# EAGLE design Fan_control_design v1.3 (EAGLE 7.7.0)
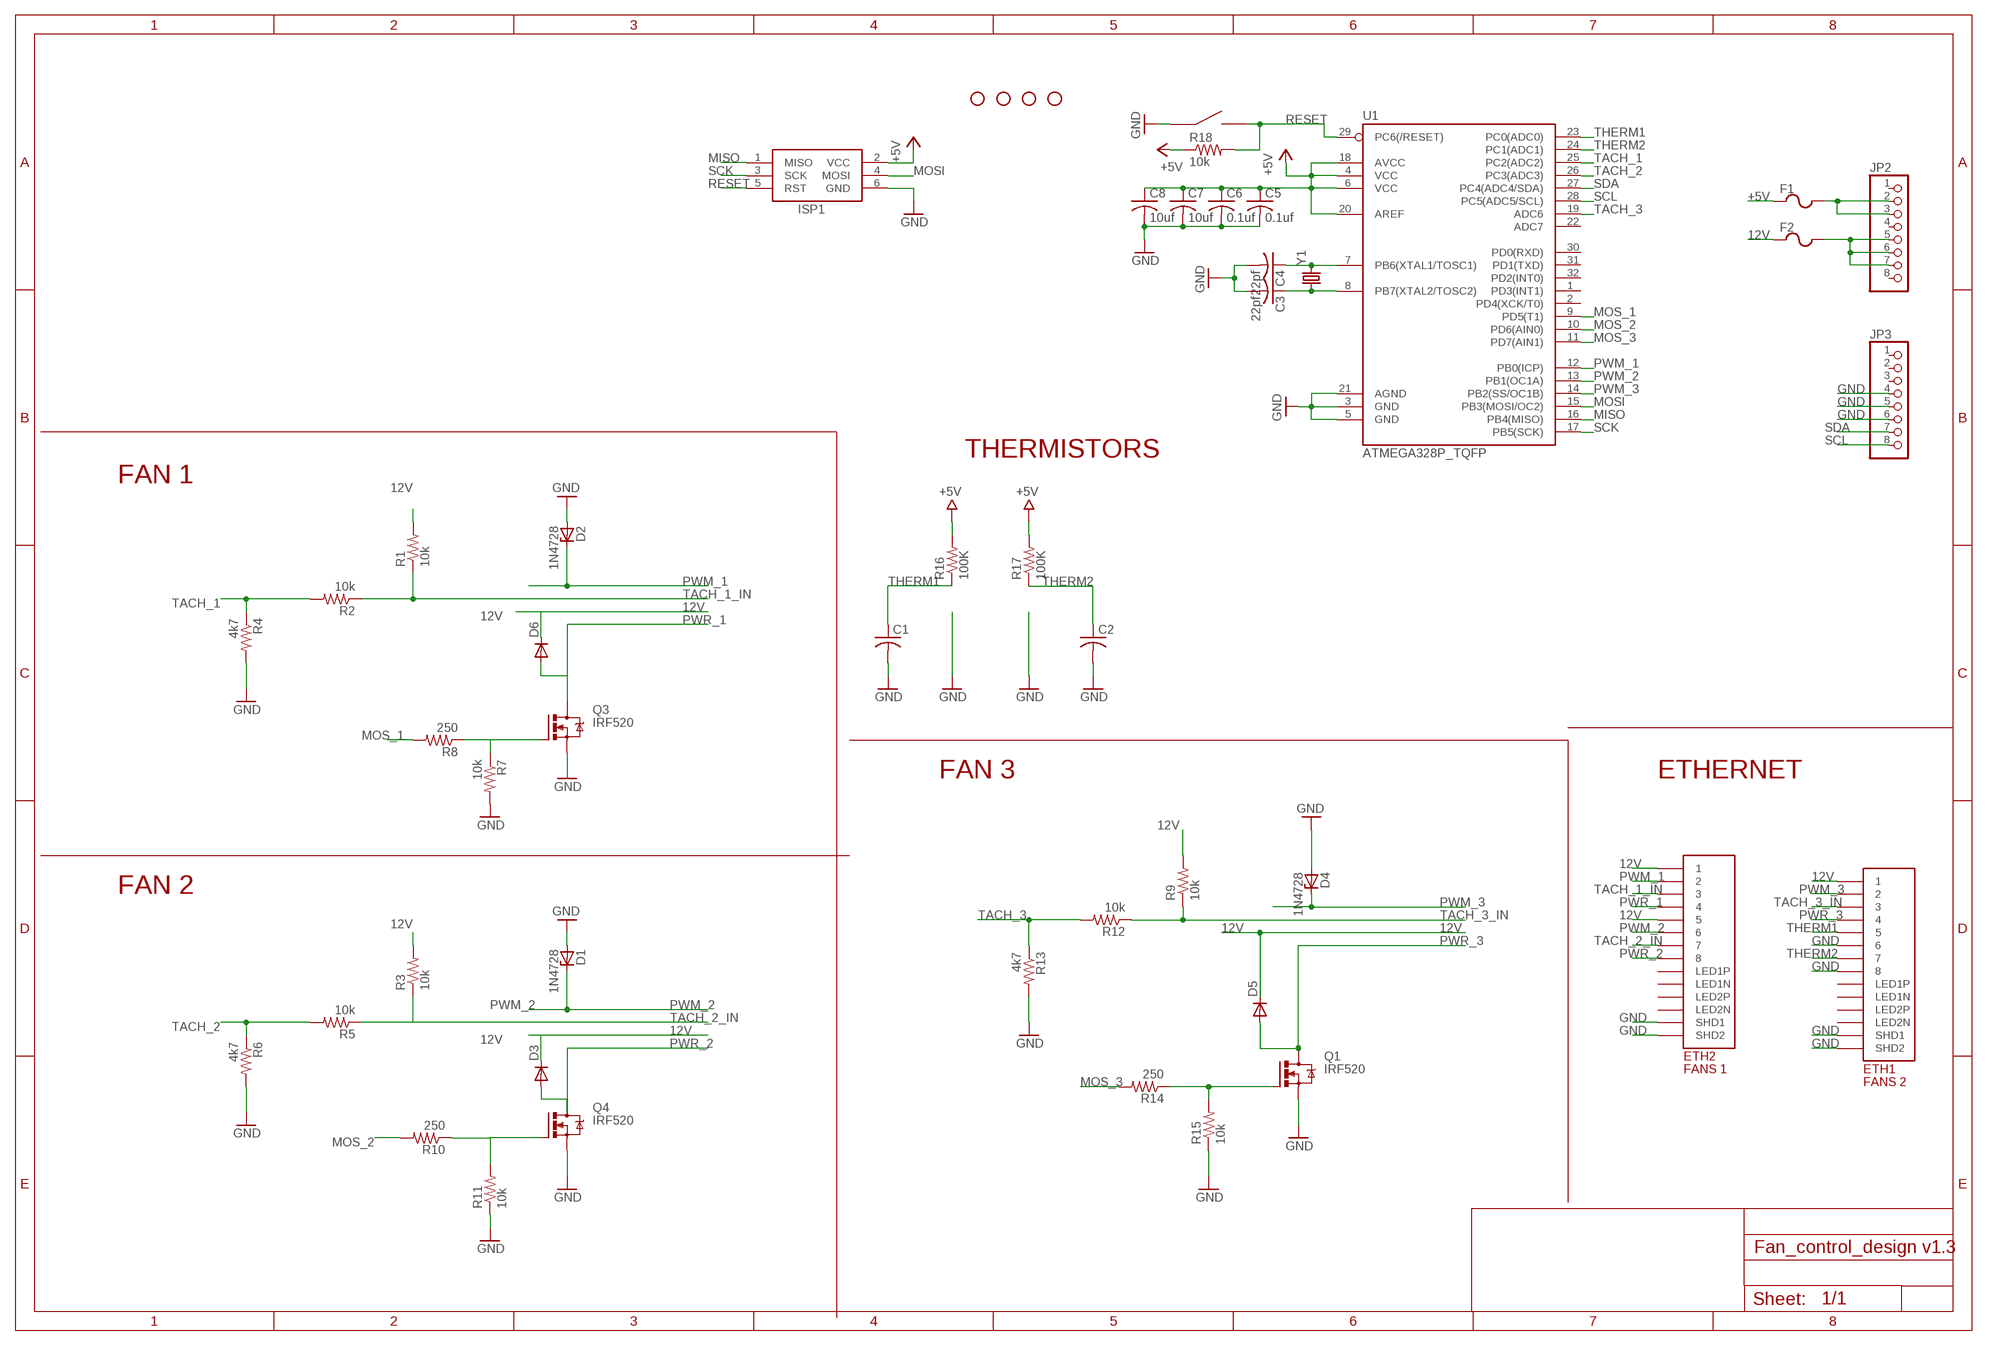
[diagram p0: schematic, sheet 1]

## Parts
C1  C-USC0603K  [C0603K]
C2  C-USC0603K  [C0603K]
C3  22pf  C-USC0603  [C0603]
C4  22pf  C-USC0603  [C0603]
C5  0.1uf  C-USC0603  [C0603]
C6  0.1uf  C-USC0603  [C0603]
C7  10uf  C-USC0603  [C0603]
C8  10uf  C-USC0603  [C0603]
D1  1N4728  [DO41Z10]
D2  1N4728  [DO41Z10]
D3  DIODE-DO214AC  [DO214AC]
D4  1N4728  [DO41Z10]
D5  DIODE-DO214AC  [DO214AC]
D6  DIODE-DO214AC  [DO214AC]
ETH1  FANS 2  ETHERNET  [A122645-ND]
ETH2  FANS 1  ETHERNET  [A122645-ND]
F1  POLYFUSE  [1206]
F2  POLYFUSE  [1206]
ISP1  AVRISP-BOX  [AVRISP-BOX]
JP2  PINHD-1X8BIG  [1X08-BIG]
JP3  PINHD-1X8BIG  [1X08-BIG]
Q1  IRF520  [TO220BV]
Q3  IRF520  [TO220BV]
Q4  IRF520  [TO220BV]
R1  10k  R-US_R0603  [R0603]
R2  10k  R-US_R0603  [R0603]
R3  10k  R-US_R0603  [R0603]
R4  4k7  R-US_R0603  [R0603]
R5  10k  R-US_R0603  [R0603]
R6  4k7  R-US_R0603  [R0603]
R7  10k  R-US_R0603  [R0603]
R8  250  R-US_R0603  [R0603]
R9  10k  R-US_R0603  [R0603]
R10  250  R-US_R0603  [R0603]
R11  10k  R-US_R0603  [R0603]
R12  10k  R-US_R0603  [R0603]
R13  4k7  R-US_R0603  [R0603]
R14  250  R-US_R0603  [R0603]
R15  10k  R-US_R0603  [R0603]
R16  100K  R-US_R0603  [R0603]
R17  100K  R-US_R0603  [R0603]
R18  10k  R-US_R0603  [R0603]
STANDOFF1  STAND-OFF  [STAND-OFF]
STANDOFF2  STAND-OFF  [STAND-OFF]
STANDOFF3  STAND-OFF  [STAND-OFF]
STANDOFF4  STAND-OFF  [STAND-OFF]
U1  ATMEGA328P_TQFP  [TQFP32-08]
U$3  EG4621CT-ND  [EG4621CT-ND]
Y1  CRYSTALHC49US  [HC49US]

## Nets
12V: D3.C D5.C D6.C ETH1.P$1 ETH2.P$1 ETH2.P$5 F2.1 R1.2 R3.2 R9.2
+5V: C5.1 C6.1 C7.1 C8.1 F1.1 ISP1.2(VCC) R16.2 R17.2 R18.1 U1.4(VCC) U1.6(VCC) U1.18(AVCC) U1.20(AREF)
GND: C1.2 C2.2 C3.2 C4.2 C5.2 C6.2 C7.2 C8.2 D1.A D2.A D4.A ETH1.P$6 ETH1.P$8 ETH1.P$13(SHD1) ETH1.P$14(SHD2) ETH2.P$13(SHD1) ETH2.P$14(SHD2) ISP1.6(GND) JP3.4 JP3.5 JP3.6 Q1.S Q3.S Q4.S R4.2 R6.2 R7.2 R11.1 R13.2 R15.1 U1.3(GND) U1.5(GND) U1.21(AGND) U$3.P$1 U$3.P$2
MISO: ISP1.1(MISO) U1.16(PB4(MISO))
MOS_1: R8.2 U1.9(PD5(T1))
MOS_2: R10.2 U1.10(PD6(AIN0))
MOS_3: R14.2 U1.11(PD7(AIN1))
MOSI: ISP1.4(MOSI) U1.15(PB3(MOSI/OC2))
N$1: F1.2 JP2.2 JP2.3
N$2: F2.2 JP2.5 JP2.6 JP2.7
N$3: C3.1 U1.8(PB7(XTAL2/TOSC2)) Y1.1
N$5: Q3.G R7.1 R8.1
N$6: C4.1 U1.7(PB6(XTAL1/TOSC1)) Y1.2
N$8: Q4.G R10.1 R11.2
N$10: Q1.G R14.1 R15.2
PWM_1: D2.C ETH2.P$2 U1.12(PB0(ICP))
PWM_2: D1.C ETH2.P$6 U1.13(PB1(OC1A))
PWM_3: D4.C ETH1.P$2 U1.14(PB2(SS/OC1B))
PWR_1: D6.A ETH2.P$4 Q3.D
PWR_2: D3.A ETH2.P$8 Q4.D
PWR_3: D5.A ETH1.P$4 Q1.D
RESET: ISP1.5(RST) R18.2 U1.29(PC6(/RESET)) U$3.P$3 U$3.P$4
SCK: ISP1.3(SCK) U1.17(PB5(SCK))
SCL: JP3.8 U1.28(PC5(ADC5/SCL))
SDA: JP3.7 U1.27(PC4(ADC4/SDA))
TACH_1: R2.2 R4.1 U1.25(PC2(ADC2))
TACH_1_IN: ETH2.P$3 R1.1 R2.1
TACH_2: R5.2 R6.1 U1.26(PC3(ADC3))
TACH_2_IN: ETH2.P$7 R3.1 R5.1
TACH_3: R12.2 R13.1 U1.19(ADC6)
TACH_3_IN: ETH1.P$3 R9.1 R12.1
THERM1: C1.1 ETH1.P$5 R16.1 U1.23(PC0(ADC0))
THERM2: C2.1 ETH1.P$7 R17.1 U1.24(PC1(ADC1))
Unconnected: ETH1.P$9(LED1N) ETH1.P$10(LED1P) ETH1.P$11(LED2N) ETH1.P$12(LED2P) ETH2.P$9(LED1N) ETH2.P$10(LED1P) ETH2.P$11(LED2N) ETH2.P$12(LED2P) JP2.1 JP2.4 JP2.8 JP3.1 JP3.2 JP3.3 U1.1(PD3(INT1)) U1.2(PD4(XCK/T0)) U1.22(ADC7) U1.30(PD0(RXD)) U1.31(PD1(TXD)) U1.32(PD2(INT0))

## Notes on the sheet
- THERMISTORS
- FAN 1
- FAN 3 | ETHERNET
- FAN 2

## Library data of the parts
C1-C8 = adafruit:C-US: CAPACITOR, American symbol
D1 D2 D4 = diode:1N4728: Z DIODE 3.3 V, 1W, 5 percent
D3 D5 D6 = diode:DIODE-: DIODE
ETH1 ETH2 = ETHERNET:ETHERNET: Ethernet port with 2 leds. digikey number A122645-ND
F1 F2 = polyfuse:POLYFUSE: Resistor Basic schematic elements and footprints for 0603, 1206, and PTH resistors.
ISP1 = adafruit:AVRISP: AVR ISP HEADER Standard 6 pin header for AVR programming
JP2 JP3 = adafruit:PINHD-1X8: PIN HEADER
Q1 Q3 Q4 = transistor-power:IRF520: HEXFET Power MOSFET
R1-R18 = adafruit:R-US_: RESISTOR, American symbol
STANDOFF1-STANDOFF4 = SparkFun-Electromechanical:STAND-OFF: #4 Stand Off This is the mechanical footprint for a #4 phillips button head screw. Use the keepout ring to avoid running the screw head into surrounding components. SKU : PRT-00447
U1 = SparkFun-DigitalIC:ATMEGA328P_TQFP; PROD_ID: IC-09069
U$3 = EG4621CT-ND:EG4621CT-ND: surface mount push putton digikey number EG4621CT-ND
Y1 = SparkFun-FreqCtrl:CRYSTAL: Various standard crystals. Proven footprints.

## Net classes
0 default: width 0.254 mm, drill 0.61 mm, clearance 0.203 mm

## Board
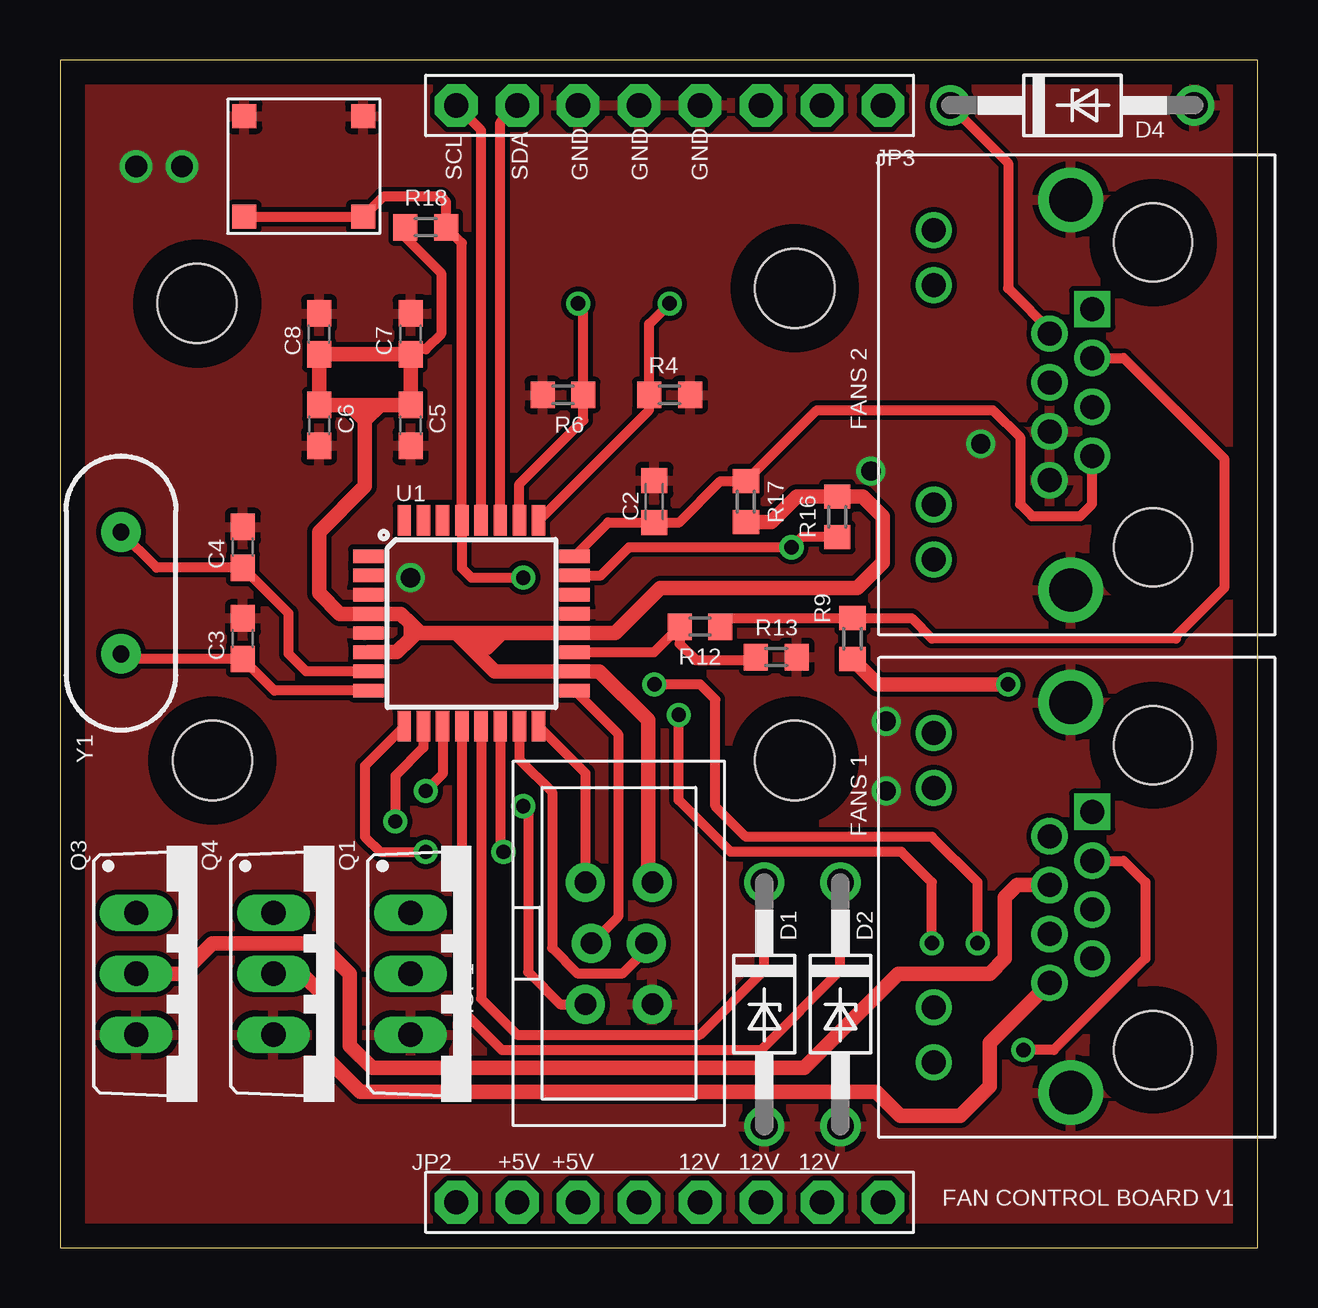
[diagram p1: board, top side]
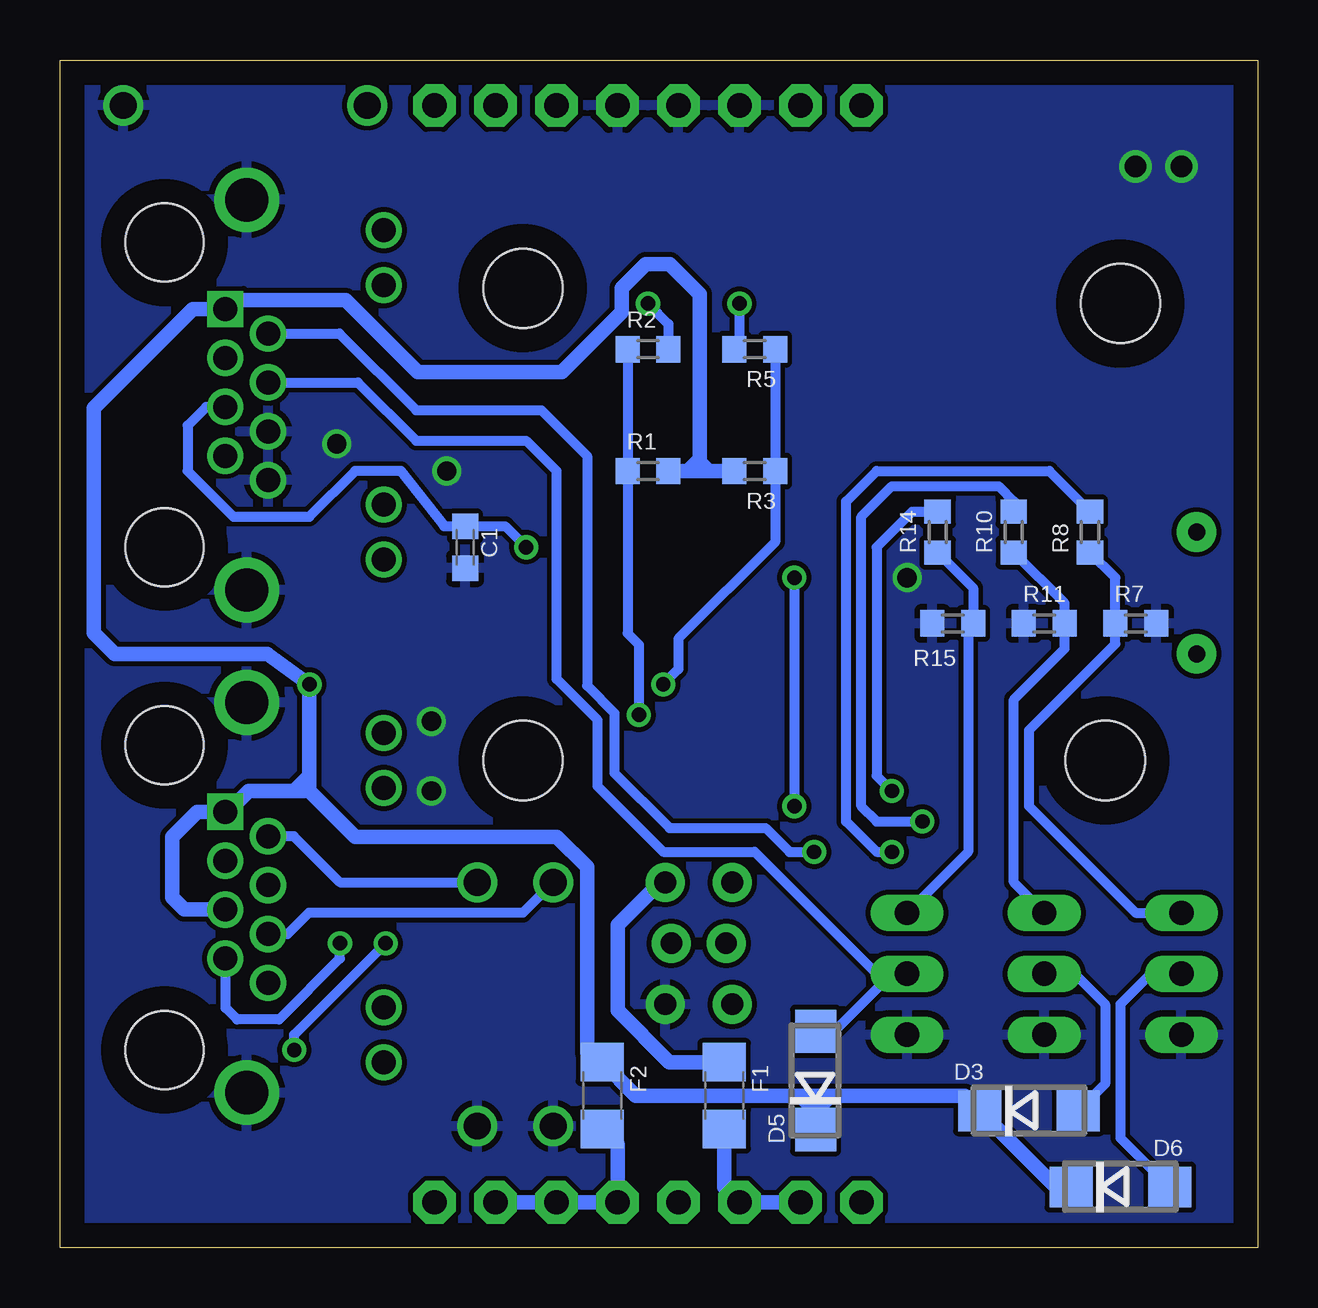
[diagram p2: board, bottom side, seen from below]

Size 49.9 x 49.52 mm. Coordinates in mm from the lower left corner, seen from the top.
Outline: 0,0 49.9,0 49.9,49.52 0,49.52 0,0
Copper layers (1*16): Top 0.035mm / dielectric 1.5mm / Bottom 0.035mm
Design rules "default": minimum track width 10mil, minimum drill 24mil, track to track 8mil, track to pad 8mil, pad to pad 8mil, via to via 8mil, smd to smd 8mil, copper to edge 40mil, drill to drill 8mil, minimum pad ring 10mil, minimum via ring 8mil, stop-mask expansion 4mil, vias tented up to drill 0mil, thermal gap 10mil

### Footprints (pad centres in the part's own frame; a part is rotated, then mirrored left to right if it is on the bottom)
C0603K = smd 1.05 x 1.08: 1 -0.875,0; 2 0.875,0
C0603 = smd 1.1 x 1: 1 -0.85,0; 2 0.85,0
DO41Z10 = drill 1.118: A 5.08,0; C -5.08,0
DO214AC = smd 1.8 x 1.7: A 2.05,0; C -2.05,0
A122645-ND = drill 1 square: P$1 3.58,2.54 | drill 1: P$2 2.56,4.32; P$3 1.54,2.54; P$4 0.52,4.32; P$5 -0.5,2.54; P$6 -1.52,4.32; P$7 -2.54,2.54; P$8 -3.56,4.32; P$9 -6.86,9.14; P$10 -4.57,9.14; P$11 4.57,9.14; P$12 6.86,9.14 | drill 1.8: P$13 -8.13,3.43; P$14 8.13,3.43 | hole 3.25: -6.35,0; 6.35,0
1206 = smd 1.6 x 1.8: 1 -1.4,0; 2 1.4,0
AVRISP-BOX = drill 0.9 pad 1.626: 1 -1.397,2.54; 2 1.397,2.54; 3 -1.143,0; 4 1.143,0; 5 -1.397,-2.54; 6 1.397,-2.54
1X08-BIG = drill 1.016 pad 1.778 octagon: 1 -8.89,0; 2 -6.35,0; 3 -3.81,0; 4 -1.27,0; 5 1.27,0; 6 3.81,0; 7 6.35,0; 8 8.89,0
TO220BV = drill 1.016 long: D 0,-2.54; G -2.54,-2.54; S 2.54,-2.54
R0603 = smd 1 x 1.1: 1 -0.85,0; 2 0.85,0
STAND-OFF = hole 3.302: 0,0
TQFP32-08 = smd 1.27 x 0.559: 1 -4.293,2.8; 2 -4.293,2; 3 -4.293,1.2; 4 -4.293,0.4; 5 -4.293,-0.4; 6 -4.293,-1.2; 7 -4.293,-2; 8 -4.293,-2.8; 17 4.293,-2.8; 18 4.293,-2; 19 4.293,-1.2; 20 4.293,-0.4; 21 4.293,0.4; 22 4.293,1.2; 23 4.293,2; 24 4.293,2.8 | smd 0.559 x 1.27: 9 -2.8,-4.293; 10 -2,-4.293; 11 -1.2,-4.293; 12 -0.4,-4.293; 13 0.4,-4.293; 14 1.2,-4.293; 15 2,-4.293; 16 2.8,-4.293; 25 2.8,4.293; 26 2,4.293; 27 1.2,4.293; 28 0.4,4.293; 29 -0.4,4.293; 30 -1.2,4.293; 31 -2,4.293; 32 -2.8,4.293
EG4621CT-ND = smd 1 x 1: P$1 -2.475,2.1; P$2 2.475,2.1; P$3 -2.475,-2.1; P$4 2.475,-2.1
HC49US = drill 0.7 pad 1.651: 1 -2.54,0; 2 2.54,0

### Placement (x,y rotation side)
C1  33.02,29.21 270 bottom
C2  24.77,31.11 90 top
C3  7.62,25.4 90 top
C4  7.62,29.21 90 top
C5  14.61,34.29 270 top
C6  10.79,34.29 270 top
C7  14.61,38.1 90 top
C8  10.79,38.1 90 top
D1  29.34,10.16 270 top
D2  32.52,10.16 270 top
D3  9.53,5.71 0 bottom
D4  42.18,47.62 0 top
D5  18.41,6.99 90 bottom
D6  5.71,2.54 0 bottom
ETH1  45.55,35.56 90 top
ETH2  45.55,14.61 90 top
F1  22.23,6.35 270 bottom
F2  27.3,6.35 270 bottom
ISP1  23.29,12.7 0 top
JP2  25.4,1.91 0 top
JP3  25.4,47.62 180 top
Q1  17.14,11.43 270 top
Q3  5.71,11.43 270 top
Q4  11.43,11.43 270 top
R1  25.4,32.38 0 bottom
R2  25.4,37.47 0 bottom
R3  20.95,32.38 180 bottom
R4  25.4,35.56 0 top
R5  20.95,37.47 180 bottom
R6  20.95,35.56 180 top
R7  5.08,26.04 0 bottom
R8  6.99,29.84 90 bottom
R9  33.02,25.4 270 top
R10  10.16,29.84 90 bottom
R11  8.89,26.04 0 bottom
R12  26.67,25.9 180 top
R13  29.84,24.63 0 top
R14  13.34,29.84 90 bottom
R15  12.7,26.04 0 bottom
R16  32.38,30.48 90 top
R17  28.57,31.11 270 top
R18  15.24,42.55 0 top
STANDOFF1  30.61,20.32 0 top
STANDOFF2  6.35,20.32 0 top
STANDOFF3  30.61,40.01 0 top
STANDOFF4  5.71,39.37 0 top
U1  17.14,26.04 0 top
U$3  10.16,45.09 0 top
Y1  2.54,27.3 90 top

### Tracks (layer width: path | path; a pad name or v marks a point on that pad's centre or on a via)
12V  (via drill 0.6)
  Top 0.61: v39.51,23.5 34.08,23.5 R9.2
  Bottom 0.61: D6.C 8.4,2.54 D3.C 12.21,6.35 17.78,6.35 | 17.78,6.35 19.05,6.35 | 18.41,5.71 17.78,6.35 | D5.C 18.41,5.71 | 18.41,5.71 19.05,6.35 | 40.14,19.05 42.05,19.05 42.91,18.18 ETH2.P$1 44.18,18.18 45.22,17.14 45.22,14.61 44.72,14.11 ETH2.P$5 | 40.14,19.05 39.51,19.05 | 39.51,19.05 37.6,17.14 29.21,17.14 27.94,15.88 27.94,8.12 27.43,7.62 F2.1 25.91,6.35 19.05,6.35 | 23.24,32.89 23.24,39.75 24.49,41 25.5,41 26.5,40 26.5,39 29,36.5 35,36.5 38,39.5 42.65,39.5 ETH1.P$1 44.36,39.14 48.5,35 48.5,25.64 47.62,24.77 41.27,24.77 v39.51,23.5 39.51,19.05 | 23.24,32.89 23.24,32.77 | 23.24,32.77 23.24,32.38 | R3.2 22.86,32.38 | 22.86,32.38 23.24,32.77 | 23.75,32.38 23.24,32.89 | R1.2 22.86,32.38 | 39.51,19.68 40.14,19.05
+5V
  Top 0.406: R18.1 14.39,42.12 15.88,40.64 15.88,38.1 15.24,37.47 14.82,37.47 C7.1
  Top 0.61: U1.6 14.04,24.84 14.61,25.4 | 14.61,25.4 14.61,26.04 | 14.61,26.04 14.21,26.43 U1.4 11.66,26.43 10.79,27.3 10.79,29.84 12.7,31.75 12.7,34.51 | 18.41,25.64 U1.20 23.14,25.64 25,27.5 33.22,27.5 34.29,28.57 34.29,30.48 33.44,31.33 R16.2 30.7,31.33 29.63,30.27 R17.2 | 18.41,25.64 16.51,25.64 | 15.01,25.64 14.61,26.04 | 18.41,25.64 17.78,25 17.78,25.4 17.14,25.4 | 16.51,25.64 18.11,24.04 U1.18 22.46,24.04 24.5,22 24.5,15.42 ISP1.2 | 16.51,25.64 14.84,25.64 14.61,25.4 | C6.1 C8.1 C7.1 C5.1 13.34,35.14 | 13.34,35.14 12.06,35.14 | 12.06,35.14 C6.1 | C6.1 10.79,34.92 | 12.7,34.51 12.06,35.14 | 12.7,34.51 13.34,35.14
  Bottom 0.61: F1.1 24.51,7.75 26.67,9.91 26.67,13.46 24.89,15.24 ISP1.2
GND  (via drill 0.8, 0.9)
  other vias: 3.17,45.09 5.08,45.09 14.61,27.94 38.37,33.52 34.42,21.95 34.42,19.05 33.79,32.38
  pour Top: 0,50.4 50.8,50.16 50.8,0.27 0,0
  pour Bottom: 0,50.49 50.8,50.49 50.8,0 0,0
MISO
  Top 0.406: U1.16 21.89,19.8 ISP1.1
MOS_1  (via drill 0.6)
  Top 0.406: U1.9 12.7,20.1 12.7,17.14 13.34,16.51 v15.24,16.51
  Bottom 0.406: R8.2 8.68,32.38 15.88,32.38 17.14,31.11 17.14,17.78 15.88,16.51 v15.24,16.51
MOS_2  (via drill 0.6)
  Top 0.406: U1.10 15.14,20.86 13.97,19.68 v13.97,17.78
  Bottom 0.406: R10.2 10.16,31.11 10.79,31.75 15.24,31.75 16.51,30.48 16.51,18.41 15.88,17.78 v13.97,17.78
MOS_3  (via drill 0.6)
  Top 0.406: U1.11 15.95,19.75 v15.24,19.05
  Bottom 0.406: R14.2 14.39,30.7 15.88,29.21 15.88,19.68 v15.24,19.05
MOSI
  Top 0.406: U1.15 19.14,20.36 20.5,19 20.5,12.5 21.55,11.45 23.45,11.45 24.43,12.43 ISP1.4
N$1
  Bottom 0.61: JP2.2 JP2.3 22.23,2.54 F1.2
N$2
  Bottom 0.61: JP2.7 JP2.6 JP2.5 26.67,4.32 F2.2
N$3
  Top 0.406: U1.8 8.94,23.23 C3.1 2.75,24.55 Y1.1
N$5
  Bottom 0.406: Q3.G 5.08,13.97 9.53,18.41 9.53,21.59 5.93,25.18 R7.1 5.93,27.94 R8.1
N$6
  Top 0.406: U1.7 10.26,24.04 9.53,24.77 9.53,26.45 C4.1 4.03,28.36 Y1.2
N$8
  Bottom 0.406: Q4.G 10.16,15.24 10.16,22.86 8.04,24.98 R11.2 8.04,26.88 R10.1
N$10
  Bottom 0.406: R14.1 11.85,27.51 R15.2 12.06,25.82 12.06,16.51 Q1.G
PWM_1
  Top 0.406: U1.12 16.75,9.93 18.41,8.26 29.21,8.26 32.52,11.56 D2.C
  Bottom 0.406: D2.C 38.23,15.24 40.16,17.16 ETH2.P$2
PWM_2
  Top 0.406: U1.13 17.55,10.39 19.05,8.89 26.67,8.89 29.34,11.56 D1.C
  Bottom 0.406: D1.C 30.61,13.97 39.53,13.97 40.41,13.09 ETH2.P$6
PWM_3  (via drill 0.6)
  Top 0.406: ETH1.P$2 41.39,38.12 39.51,40.01 39.51,45.22 D4.C | U1.14 18.34,16.64 v18.48,16.51
  Bottom 0.406: ETH1.P$2 38.26,38.12 35.06,34.92 29.84,34.92 27.94,33.02 27.94,23.44 26.8,22.3 26.8,19.8 24.5,17.5 20.5,17.5 19.5,16.5 v18.49,16.5 v18.48,16.51
PWR_1
  Top 0.61: ETH2.P$4 39.89,15.12 39.37,14.61 39.37,12.06 38.73,11.43 34.92,11.43 31,7.5 13,7.5 12.06,8.44 12.06,11.43 10.79,12.7 6.35,12.7 5.08,11.43 Q3.D
  Bottom 0.406: Q3.D 4.45,11.43 5.71,10.16 5.71,4.59 D6.A
PWR_2
  Top 0.61: ETH2.P$8 38.73,8.55 38.73,6.74 37.5,5.5 35,5.5 34,6.5 12.5,6.5 11,8 11,10.5 10.07,11.43 Q4.D
  Bottom 0.406: Q4.D 7.62,11.43 6.35,10.16 6.35,6.84 D3.A
PWR_3
  Bottom 0.406: D5.A 17.64,9.04 15.24,11.43 Q1.D 15.88,11.43 20.95,16.51 24.77,16.51 27.5,19.25 27.5,22 29.21,23.71 29.21,32.38 30.48,33.66 35.06,33.66 37.48,36.08 ETH1.P$4
RESET  (via drill 0.6)
  Top 0.406: U$3.P$3 U$3.P$4 13.46,43.81 15.88,43.81 16.09,43.6 R18.2 16.75,41.89 U1.29 16.75,28.34 17.14,27.94 v19.3,27.94 | v19.3,18.41 19.5,18.21 19.5,11.5 20.84,10.16 ISP1.5
  Bottom 0.406: v19.3,27.94 v19.3,18.41
SCK
  Top 0.406: ISP1.3 23.25,13.81 23.25,21.42 U1.17
SCL
  Top 0.406: U1.28 17.55,46.59 JP3.8
SDA
  Top 0.406: U1.27 18.34,46.92 JP3.7
TACH_1  (via drill 0.6)
  Top 0.406: U1.25 24.55,34.93 R4.1 24.55,38.52 v25.4,39.37
  Bottom 0.406: v25.4,39.37 24.55,38.52 R2.2
TACH_1_IN  (via drill 0.6)
  Top 0.406: ETH2.P$3 44.31,16.14 45.22,15.24 45.22,12.06 41.41,8.26 v40.14,8.26 | v36.33,12.7 36.33,15.24 35.06,16.51 27.94,16.51 25.78,18.67 v25.78,22.23
  Bottom 0.406: v40.14,8.26 40.14,8.89 v36.33,12.7 | R2.1 R1.1 26.25,25.61 25.78,25.15 v25.78,22.23
TACH_2  (via drill 0.6)
  Top 0.406: U1.26 19.14,31.84 21.8,34.51 R6.1 21.8,39.16 v21.59,39.37
  Bottom 0.406: v21.59,39.37 21.59,37.68 R5.2
TACH_2_IN  (via drill 0.6)
  Top 0.406: v38.23,12.7 38.23,15.24 36.33,17.14 28.57,17.14 27.3,18.41 27.3,22.86 26.67,23.5 v24.77,23.5
  Bottom 0.406: v38.23,12.7 38.23,12.06 40.77,9.53 42.52,9.53 43,10 43,12.05 ETH2.P$7 | R5.1 R3.1 20.11,29.43 24.13,25.4 24.13,24.13 v24.77,23.5
TACH_3
  Top 0.406: U1.19 24.75,24.84 R12.2 25.82,25.18 26.5,24.5 28.86,24.5 R13.1
TACH_3_IN
  Top 0.406: ETH1.P$3 44.31,37.1 48.5,32.91 48.5,27.5 46.49,25.49 46.49,25.4 36.33,25.4 35.48,26.25 R9.1 27.87,26.25 R12.1
THERM1  (via drill 0.6)
  Top 0.406: R16.1 30.9,29.63 v30.48,29.21 26,29.21 25.71,29.21 23.71,29.21 22.54,28.04 U1.23
  Bottom 0.406: ETH1.P$5 43.81,35.06 44.59,34.29 44.59,32.38 42.68,30.48 39.51,30.48 37.6,32.38 35.7,32.38 33.9,30.09 C1.1 31.36,30.09 v30.48,29.21
THERM2
  Top 0.406: U1.24 22.84,30.24 C2.1 25.8,30.24 27.52,31.96 R17.1 31.54,34.92 38.87,34.92 40,33.8 40,31 40.5,30.5 42.5,30.5 43.01,31.01 ETH1.P$7

### Text on the board
tPlace: SCL | SDA | GND | GND | GND | +5V | +5V | 12V | 12V | 12V | FAN CONTROL BOARD V1